# EAGLE schematic schematic (EAGLE 6.2)
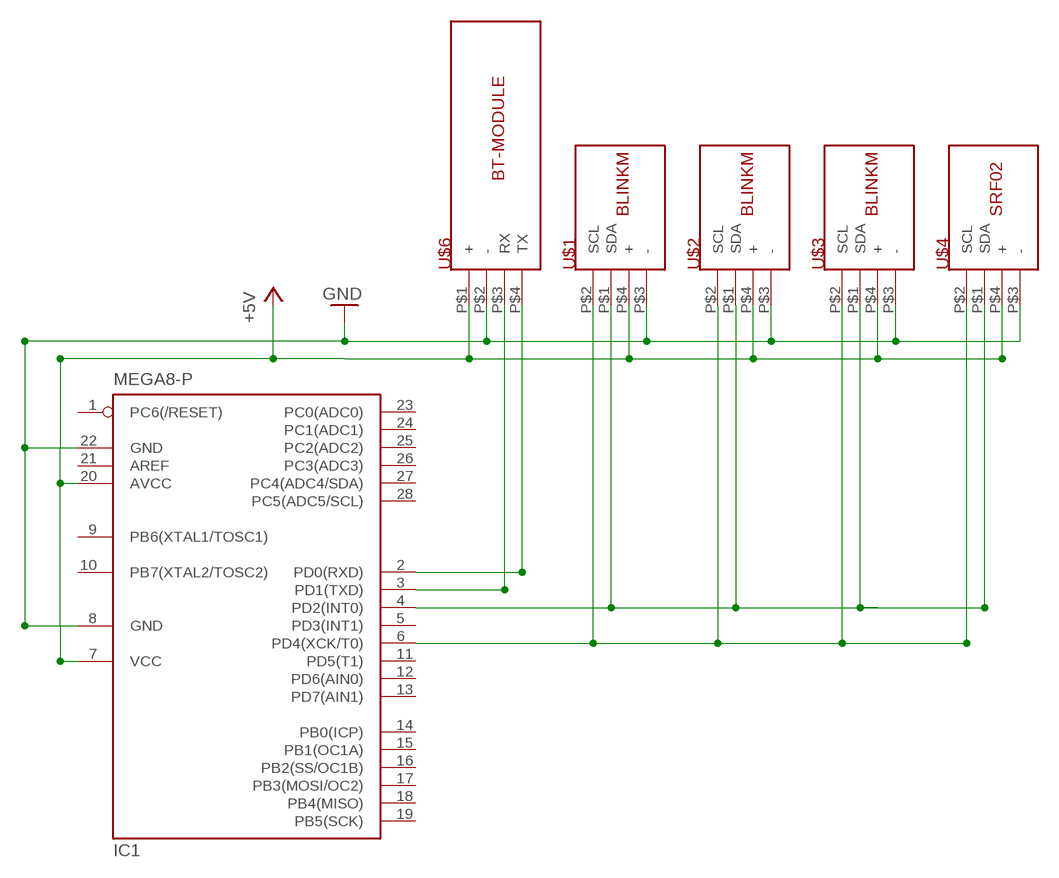
[diagram p0: schematic, sheet 1]

## Parts
IC1  MEGA8-P  [DIL28-3]
U$1  BLINKM  [BLINKM]
U$2  BLINKM  [BLINKM]
U$3  BLINKM  [BLINKM]
U$4  SRF02  BLINKM  [BLINKM]
U$6  BT-MODULE  [BT-MODULE]

## Nets
+5V: IC1.7(VCC) IC1.20(AVCC) U$1.P$4(+) U$2.P$4(+) U$3.P$4(+) U$4.P$4(+) U$6.P$1(+)
GND: IC1.8(GND) IC1.22(GND) U$1.P$3(-) U$2.P$3(-) U$3.P$3(-) U$4.P$3(-) U$6.P$2(-)
N$1: IC1.2(PD0(RXD)) U$6.P$4(TX)
N$2: IC1.3(PD1(TXD)) U$6.P$3(RX)
N$3: IC1.4(PD2(INT0)) U$1.P$1(SDA) U$2.P$1(SDA) U$3.P$1(SDA) U$4.P$1(SDA)
N$4: IC1.6(PD4(XCK/T0)) U$1.P$2(SCL) U$2.P$2(SCL) U$3.P$2(SCL) U$4.P$2(SCL)
Unconnected: IC1.1(PC6(/RESET)) IC1.5(PD3(INT1)) IC1.9(PB6(XTAL1/TOSC1)) IC1.10(PB7(XTAL2/TOSC2)) IC1.11(PD5(T1)) IC1.12(PD6(AIN0)) IC1.13(PD7(AIN1)) IC1.14(PB0(ICP)) IC1.15(PB1(OC1A)) IC1.16(PB2(SS/OC1B)) IC1.17(PB3(MOSI/OC2)) IC1.18(PB4(MISO)) IC1.19(PB5(SCK)) IC1.21(AREF) IC1.23(PC0(ADC0)) IC1.24(PC1(ADC1)) IC1.25(PC2(ADC2)) IC1.26(PC3(ADC3)) IC1.27(PC4(ADC4/SDA)) IC1.28(PC5(ADC5/SCL))

## Library data of the parts
IC1 = atmel:MEGA8-P: MICROCONTROLLER 8 Kbytes FLASH, 1 kbytes SRAM, 512 bytes EEPROM, USART, 4-channel 10 bit ADC, 2-channel 8 bit ADC Pin compatible with Atmega48, ATMega88, ATMega168 Source: avr.lbr; OC_FARNELL: unknown; OC_NEWARK: unknown
U$1-U$4 = lightrobot:BLINKM
U$6 = lightrobot:BT-MODULE